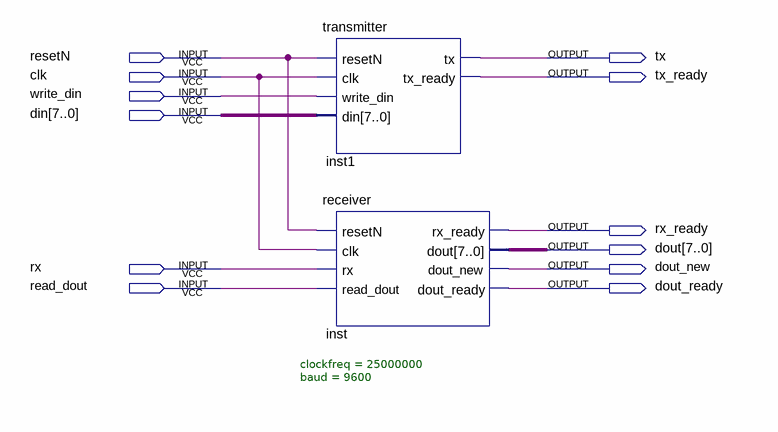
[diagram p0: schematic sheet]
// Quartus schematic UART.bdf as structural Verilog: 2 symbols, 12 pins
module UART (
  input  resetN,
  input  clk,
  input  write_din,
  input  [7:0] din,
  input  rx,
  input  read_dout,
  output tx,
  output tx_ready,
  output rx_ready,
  output [7:0] dout,
  output dout_new,
  output dout_ready
);

  transmitter inst1 (.resetN(resetN), .clk(clk), .write_din(write_din), .din(din), .tx(tx), .tx_ready(tx_ready));
  receiver #(.clockfreq(25000000), .baud(9600)) inst (
    .resetN(resetN), .clk(clk), .rx(rx), .read_dout(read_dout), .rx_ready(rx_ready), .dout(dout),
    .dout_new(dout_new), .dout_ready(dout_ready));
endmodule
